# EAGLE schematic Simple8085 (EAGLE 8.0.0)
Netronics Explorer-85 Clone
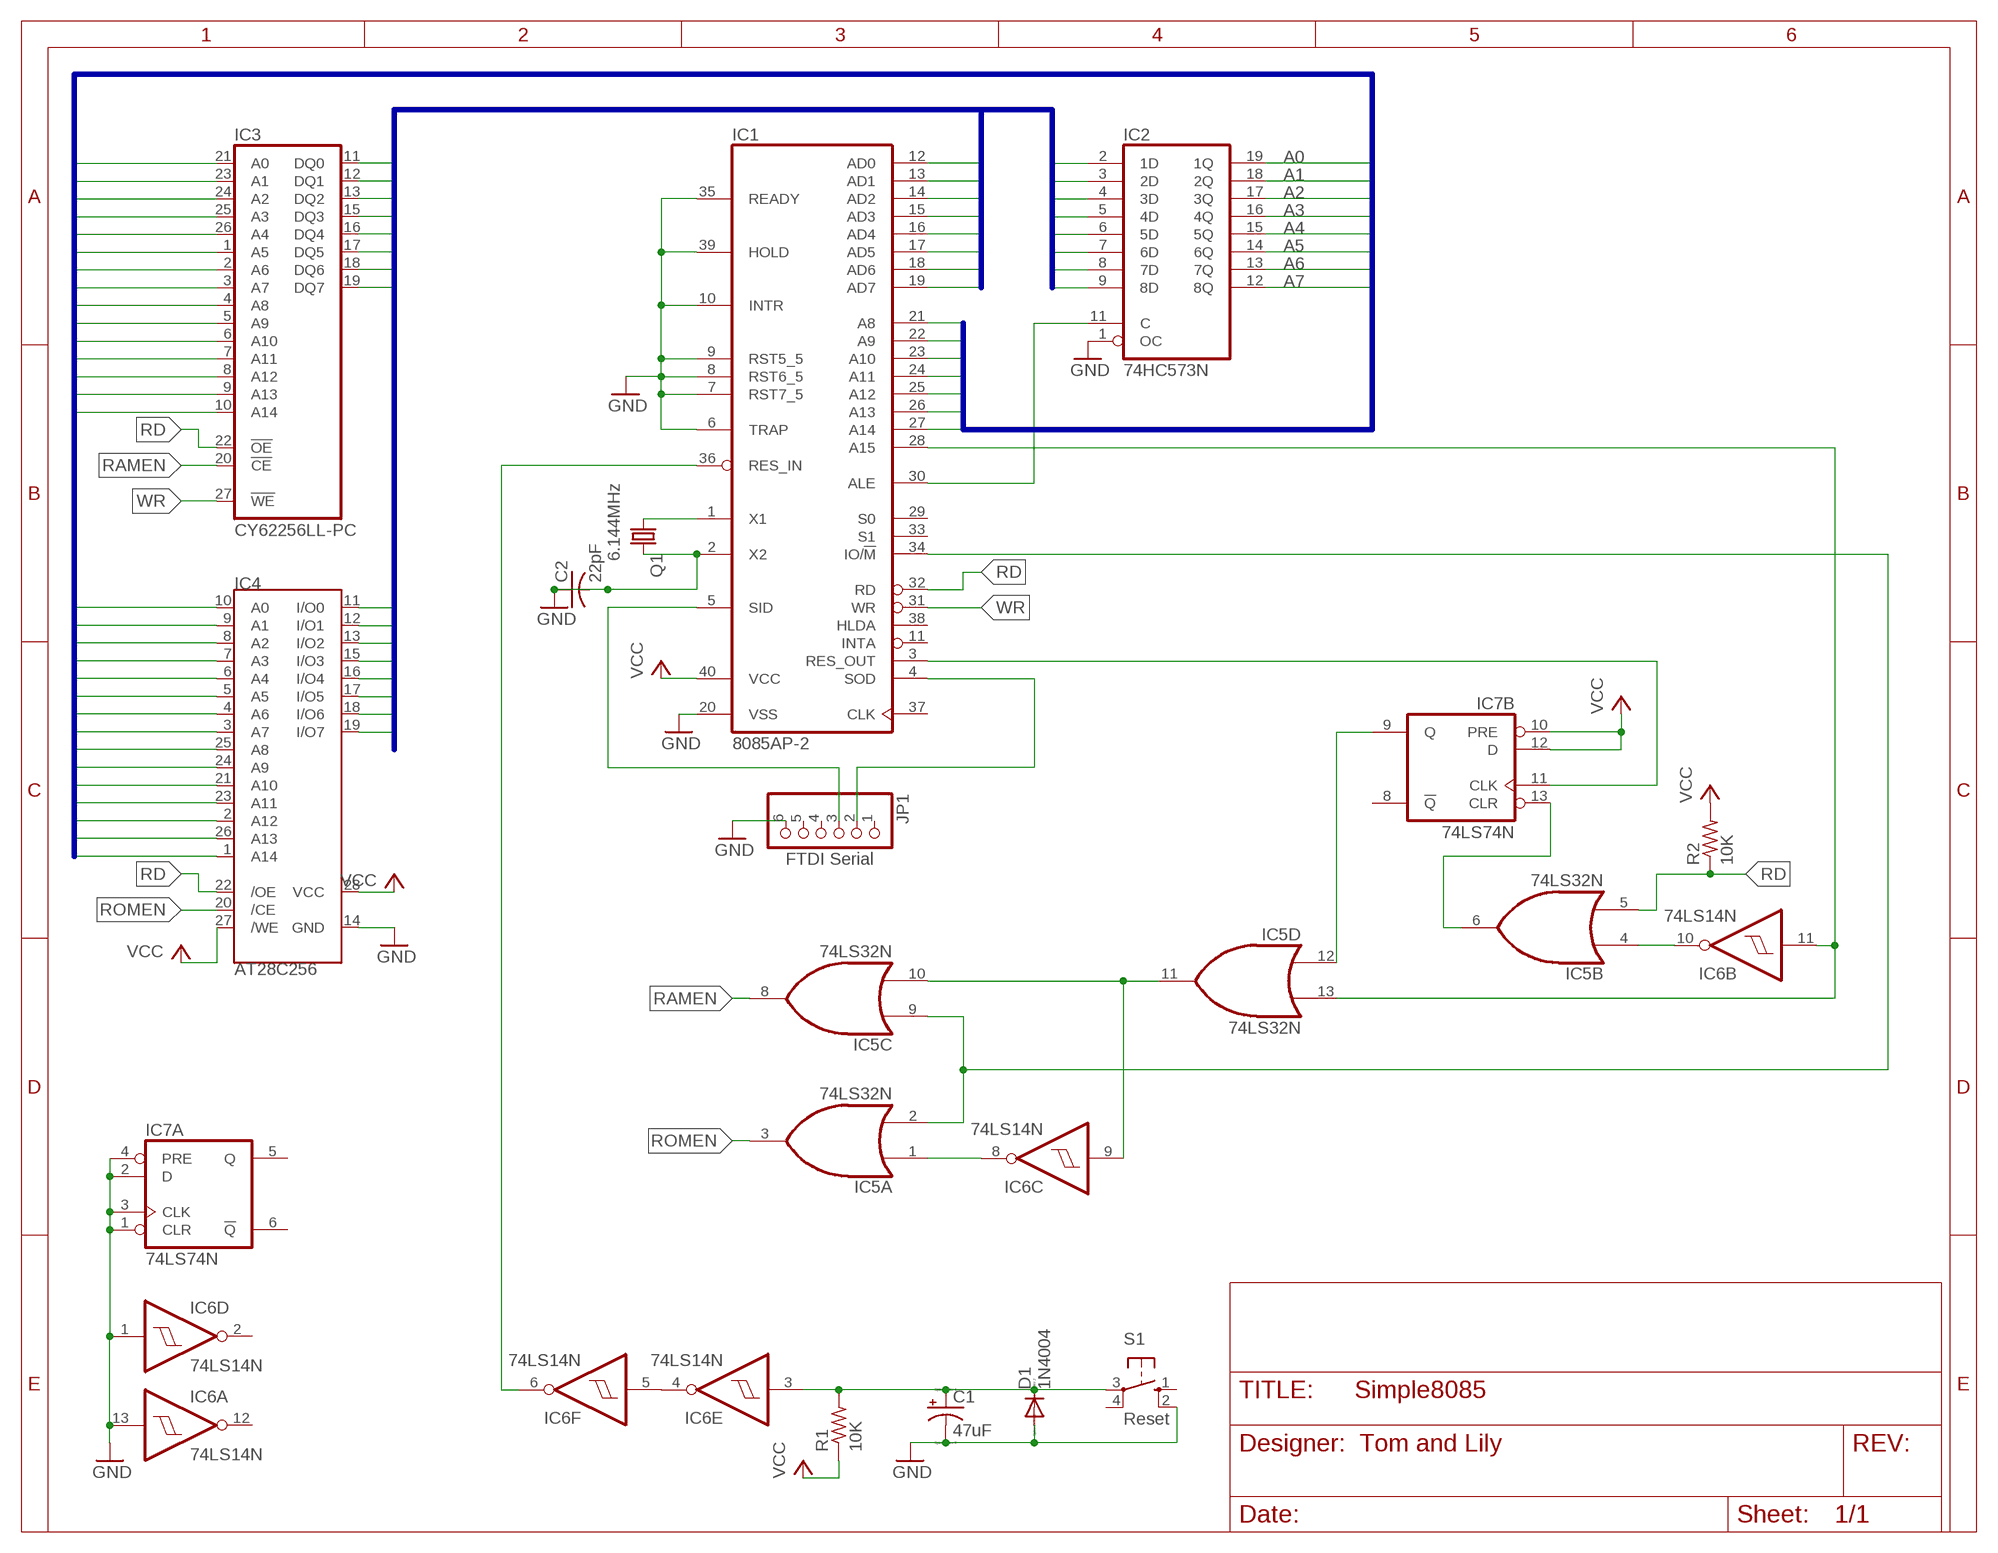
[diagram p0: schematic, sheet 1]

## Parts
C1  47uF  CPOL-USA  [PANASONIC_A]
C2  22pF  C-US025-050X050  [C025-050X050]
D1  1N4004  [DO41-10]
IC1  8085AP-2  8085  [DIL40]
IC2  74HC573N  [DIL20]
IC3  CY62256LL-PC  [DIL28-6]
IC4  AT28C256  AT28C256-28DIP  [DIL28-6]
IC5  74LS32N  [DIL14]
IC6  74LS14N  [DIL14]
IC7  74LS74N  [DIL14]
JP1  FTDI Serial  PINHD-1X6  [1X06]
Q1  6.144MHz  CRYSTALHC49U-H  [HC49U-H]
R1  10K  R-US_0204/5  [0204/5]
R2  10K  R-US_0204/5  [0204/5]
S1  Reset  10-XX  [B3F-10XX]

## Nets
A0: IC2.19(1Q) IC3.21(A0) IC4.10(A0)
A1: IC2.18(2Q) IC3.23(A1) IC4.9(A1)
A2: IC2.17(3Q) IC3.24(A2) IC4.8(A2)
A3: IC2.16(4Q) IC3.25(A3) IC4.7(A3)
A4: IC2.15(5Q) IC3.26(A4) IC4.6(A4)
A5: IC2.14(6Q) IC3.1(A5) IC4.5(A5)
A6: IC2.13(7Q) IC3.2(A6) IC4.4(A6)
A7: IC2.12(8Q) IC3.3(A7) IC4.3(A7)
A8: IC1.21(A8) IC3.4(A8) IC4.25(A8)
A9: IC1.22(A9) IC3.5(A9) IC4.24(A9)
A10: IC1.23(A10) IC3.6(A10) IC4.21(A10)
A11: IC1.24(A11) IC3.7(A11) IC4.23(A11)
A12: IC1.25(A12) IC3.8(A12) IC4.2(A12)
A13: IC1.26(A13) IC3.9(A13) IC4.26(A13)
A14: IC1.27(A14) IC3.10(A14) IC4.1(A14)
D0: IC1.12(AD0) IC2.2(1D) IC3.11(DQ0) IC4.11(I/O0)
D1: IC1.13(AD1) IC2.3(2D) IC3.12(DQ1) IC4.12(I/O1)
D2: IC1.14(AD2) IC2.4(3D) IC3.13(DQ2) IC4.13(I/O2)
D3: IC1.15(AD3) IC2.5(4D) IC3.15(DQ3) IC4.15(I/O3)
D4: IC1.16(AD4) IC2.6(5D) IC3.16(DQ4) IC4.16(I/O4)
D5: IC1.17(AD5) IC2.7(6D) IC3.17(DQ5) IC4.17(I/O5)
D6: IC1.18(AD6) IC2.8(7D) IC3.18(DQ6) IC4.18(I/O6)
D7: IC1.19(AD7) IC2.9(8D) IC3.19(DQ7) IC4.19(I/O7)
GND: C1.- C2.1 C2.2 D1.A IC1.2(X2) IC1.6(TRAP) IC1.7(RST7_5) IC1.8(RST6_5) IC1.9(RST5_5) IC1.10(INTR) IC1.20(VSS) IC1.35(READY) IC1.39(HOLD) IC2.1(OC) IC4.14(GND) IC6.1(D:I) IC6.13(A:I) IC7.1(A:CLR) IC7.2(A:D) IC7.3(A:CLK) IC7.4(A:PRE) JP1.6 Q1.2 S1.2(S1)
N$1: IC1.30(ALE) IC2.11(C)
N$2: IC5.10(C:I1) IC5.11(D:O) IC6.9(C:I)
N$3: IC6.4(E:O) IC6.5(F:I)
N$4: IC5.4(B:I0) IC6.10(B:O)
N$5: IC5.1(A:I0) IC6.8(C:O)
N$6: IC5.6(B:O) IC7.13(B:CLR)
N$7: IC5.12(D:I0) IC7.9(B:Q)
N$8: IC1.28(A15) IC5.13(D:I1) IC6.11(B:I)
N$9: IC1.34(IO/!M) IC5.2(A:I1) IC5.9(C:I0)
N$10: IC1.3(RES_OUT) IC7.11(B:CLK)
N$11: IC1.1(X1) Q1.1
N$13: IC1.5(SID) JP1.3
N$14: IC1.4(SOD) JP1.2
N$17: C1.+ D1.C IC6.3(E:I) R1.2 S1.3(P)
N$18: IC1.36(RES_IN) IC6.6(F:O)
RAMEN: IC3.20(!CE) IC5.8(C:O)
RD: IC1.32(RD) IC3.22(!OE) IC4.22(/OE) IC5.5(B:I1) R2.1
ROMEN: IC4.20(/CE) IC5.3(A:O)
VCC: IC1.40(VCC) IC4.27(/WE) IC4.28(VCC) IC7.10(B:PRE) IC7.12(B:D) R1.1 R2.2
WR: IC1.31(WR) IC3.27(!WE)
Unconnected: IC1.11(INTA) IC1.29(S0) IC1.33(S1) IC1.37(CLK) IC1.38(HLDA) IC6.2(D:O) IC6.12(A:O) IC7.5(A:Q) IC7.6(A:!Q) IC7.8(B:!Q) JP1.1 JP1.4 JP1.5 S1.1(S) S1.4(P1)

## Buses
D[0..7]
A[0..15]

## Power pins joined to a net without a drawn wire
GND: IC2.10(GND) IC3.14(GND) IC5.7(P:GND) IC6.7(P:GND) IC7.7(P:GND)
VCC: IC2.20(VCC) IC3.28(VCC) IC5.14(P:VCC) IC6.14(P:VCC) IC7.14(P:VCC)

## Library data of the parts
C1 = resistor:CPOL-US: POLARIZED CAPACITOR, American symbol
C2 = resistor:C-US: CAPACITOR, American symbol
D1 = diode:1N4004: DIODE general purpose rectifier, 1 A
IC1 = micro-intel:8085: MICROCOMPUTER/PERIPHERAL DEVICE; OC_FARNELL: unknown; OC_NEWARK: unknown
IC2 = 74xx-us:74*573: 8-bit D latch BUS DRIVER
IC3 = memory-sram:CY62256LL-?*: 256K (32K x 8) CMOS-Static RAM Source: http://download.cypress.com.edgesuite.net/design_resources/datasheets/contents/cy62256_8.pdf
IC4 = mylib_memory:AT28C256-28DIP: IC EEPROM 256KBIT 28DIP
IC5 = 74xx-us:74*32: Quad 2-input OR gate
IC6 = 74xx-us:74*14: Hex schmitt trigger INVERTER
IC7 = 74xx-us:74*74: Dual D type positive edge triggered FLIP FLOP, preset and clear
JP1 = pinhead:PINHD-1X6: PIN HEADER
Q1 = crystal:CRYSTAL: CRYSTAL; OC_FARNELL: 1666973; OC_NEWARK: unknown
R1 R2 = resistor:R-US_: RESISTOR, American symbol
S1 = switch-omron:10-XX: OMRON SWITCH; MPN: B3F-1000; OC_FARNELL: 176432; OC_NEWARK: 36M3542